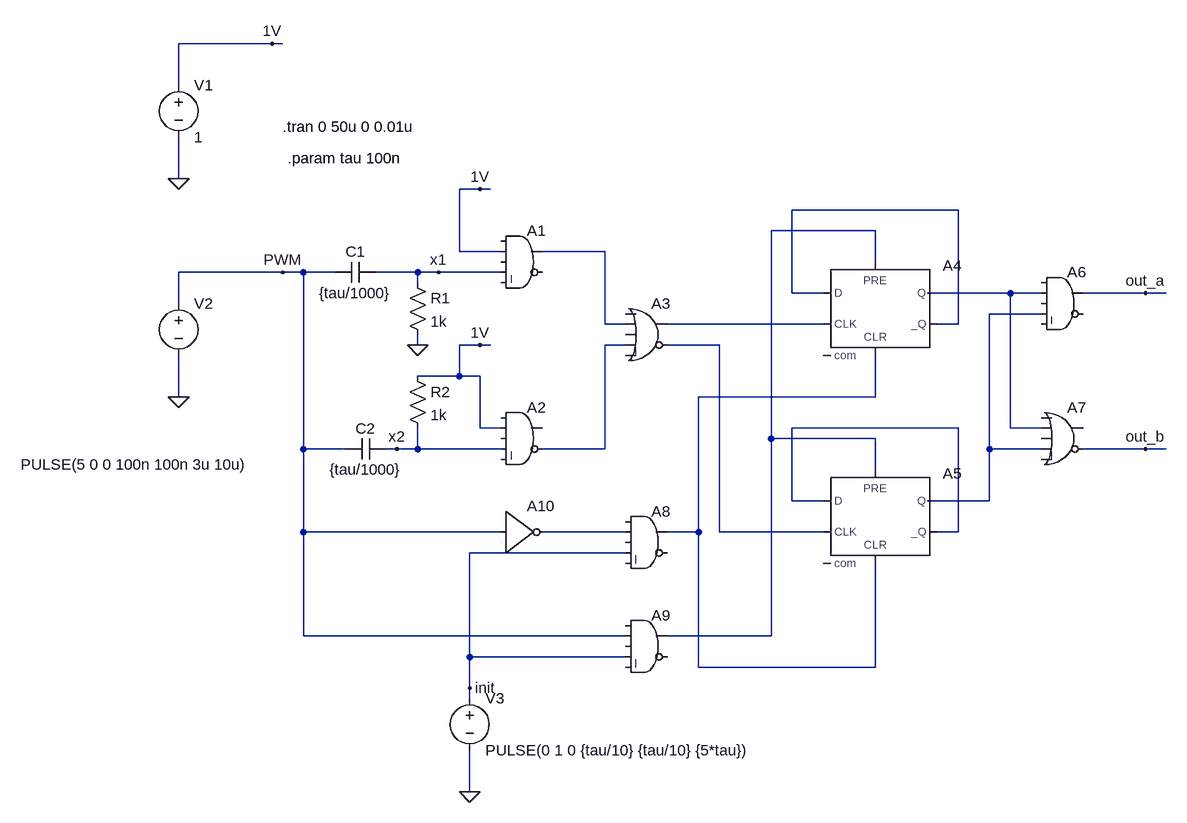
[diagram p0: schematic HB-Driver-w-programmableDT.asc]
HB-Driver-w-programmableDT.asc, the LTspice schematic file:
Version 4
SHEET 1 1492 1060
WIRE 96 -112 -48 -112
WIRE 112 -112 96 -112
WIRE -48 -48 -48 -112
WIRE -48 96 -48 32
WIRE 416 112 384 112
WIRE 432 112 416 112
WIRE 1152 144 896 144
WIRE 1024 176 864 176
WIRE 384 208 384 112
WIRE 448 208 384 208
WIRE 608 208 512 208
WIRE 1024 224 1024 176
WIRE 112 240 -48 240
WIRE 144 240 112 240
WIRE 192 240 144 240
WIRE 320 240 256 240
WIRE 352 240 320 240
WIRE 448 240 352 240
WIRE 320 256 320 240
WIRE 896 272 896 144
WIRE 944 272 896 272
WIRE 1232 272 1104 272
WIRE 1280 272 1232 272
WIRE 1440 272 1344 272
WIRE 1472 272 1440 272
WIRE -48 288 -48 240
WIRE 1280 304 1200 304
WIRE 608 320 608 208
WIRE 640 320 608 320
WIRE 944 320 704 320
WIRE 1152 320 1152 144
WIRE 1152 320 1120 320
WIRE 320 352 320 336
WIRE 416 352 384 352
WIRE 432 352 416 352
WIRE 640 352 608 352
WIRE 784 352 704 352
WIRE 384 400 384 352
WIRE 384 400 320 400
WIRE 416 400 384 400
WIRE -48 432 -48 368
WIRE 1024 432 1024 368
WIRE 1024 432 752 432
WIRE 416 480 416 400
WIRE 448 480 416 480
WIRE 1152 480 896 480
WIRE 1232 480 1232 272
WIRE 1280 480 1232 480
WIRE 864 496 864 176
WIRE 1024 496 864 496
WIRE 144 512 144 240
WIRE 208 512 144 512
WIRE 288 512 272 512
WIRE 320 512 320 480
WIRE 320 512 288 512
WIRE 448 512 320 512
WIRE 608 512 608 352
WIRE 608 512 512 512
WIRE 1200 512 1200 304
WIRE 1280 512 1200 512
WIRE 1440 512 1344 512
WIRE 1472 512 1440 512
WIRE 1024 544 1024 496
WIRE 896 592 896 480
WIRE 944 592 896 592
WIRE 1200 592 1200 512
WIRE 1200 592 1104 592
WIRE 144 640 144 512
WIRE 448 640 144 640
WIRE 640 640 512 640
WIRE 752 640 752 432
WIRE 752 640 704 640
WIRE 784 640 784 352
WIRE 944 640 784 640
WIRE 1152 640 1152 480
WIRE 1152 640 1120 640
WIRE 640 672 400 672
WIRE 144 800 144 640
WIRE 640 800 144 800
WIRE 864 800 864 496
WIRE 864 800 704 800
WIRE 400 832 400 672
WIRE 640 832 400 832
WIRE 752 848 752 640
WIRE 1024 848 1024 688
WIRE 1024 848 752 848
WIRE 400 880 400 832
WIRE 400 896 400 880
WIRE 400 1040 400 976
FLAG -48 96 0
FLAG 96 -112 1V
FLAG -48 432 0
FLAG 112 240 PWM
FLAG 320 352 0
FLAG 400 1040 0
FLAG 1440 272 out_a
FLAG 1440 512 out_b
FLAG 352 240 x1
FLAG 288 512 x2
FLAG 416 112 1V
FLAG 416 352 1V
FLAG 400 880 init
SYMBOL voltage -48 -64 R0
WINDOW 123 0 0 Left 0
WINDOW 39 0 0 Left 0
SYMATTR InstName V1
SYMATTR Value 1
SYMBOL voltage -48 272 R0
WINDOW 3 -243 264 Left 2
WINDOW 123 0 0 Left 0
WINDOW 39 0 0 Left 0
SYMATTR InstName V2
SYMATTR Value PULSE(5 0 0 100n 100n 3u 10u)
SYMBOL cap 256 224 R90
WINDOW 0 0 32 VBottom 2
WINDOW 3 32 32 VTop 2
SYMATTR InstName C1
SYMATTR Value {tau/1000}
SYMBOL cap 272 496 R90
WINDOW 0 0 32 VBottom 2
WINDOW 3 32 32 VTop 2
SYMATTR InstName C2
SYMATTR Value {tau/1000}
SYMBOL res 304 240 R0
SYMATTR InstName R1
SYMATTR Value 1k
SYMBOL res 304 384 R0
SYMATTR InstName R2
SYMATTR Value 1k
SYMBOL Digital\\and 480 160 R0
SYMATTR InstName A1
SYMBOL Digital\\and 480 432 R0
SYMATTR InstName A2
SYMBOL Digital\\or 672 272 R0
SYMATTR InstName A3
SYMBOL Digital\\dflop 1024 224 R0
SYMATTR InstName A4
SYMBOL Digital\\dflop 1024 544 R0
SYMATTR InstName A5
SYMBOL Digital\\and 1312 224 R0
SYMATTR InstName A6
SYMBOL Digital\\or 1312 432 R0
SYMATTR InstName A7
SYMBOL Digital\\and 672 592 R0
SYMATTR InstName A8
SYMBOL Digital\\and 672 752 R0
SYMATTR InstName A9
SYMBOL Digital\\inv 448 576 R0
SYMATTR InstName A10
SYMBOL voltage 400 880 R0
WINDOW 123 0 0 Left 0
WINDOW 39 0 0 Left 0
SYMATTR InstName V3
SYMATTR Value PULSE(0 1 0 {tau/10} {tau/10} {5*tau})
TEXT 112 16 Left 2 !.tran 0 50u 0 0.01u
TEXT 120 64 Left 2 !.param tau 100n

The netlist it stands for:
* HB-Driver-w-programmableDT.asc
V1 1V 0 1
V2 PWM 0 PULSE(5 0 0 100n 100n 3u 10u)
C1 x1 PWM {tau/1000}
C2 x2 PWM {tau/1000}
R1 x1 0 1k
R2 1V x2 1k
A1 0 1V 0 x1 0 0 N003 0 AND
A2 0 1V 0 x2 0 N007 0 0 AND
A3 0 N003 0 N007 0 N008 N006 0 OR
A4 N001 0 N006 N002 N009 N001 N004 0 DFLOP
A5 N010 0 N008 N002 N009 N010 N005 0 DFLOP
A6 0 N004 0 N005 0 0 out_a 0 AND
A7 0 N004 0 N005 0 out_b 0 0 OR
A8 0 N011 0 init 0 0 N009 0 AND
A9 0 PWM 0 init 0 0 N002 0 AND
A10 PWM 0 0 0 0 N011 0 0 BUF
V3 init 0 PULSE(0 1 0 {tau/10} {tau/10} {5*tau})
.tran 0 50u 0 0.01u
.param tau 100n
.backanno
.end

* Results of the author's LTspice run, read from the files saved beside the schematic
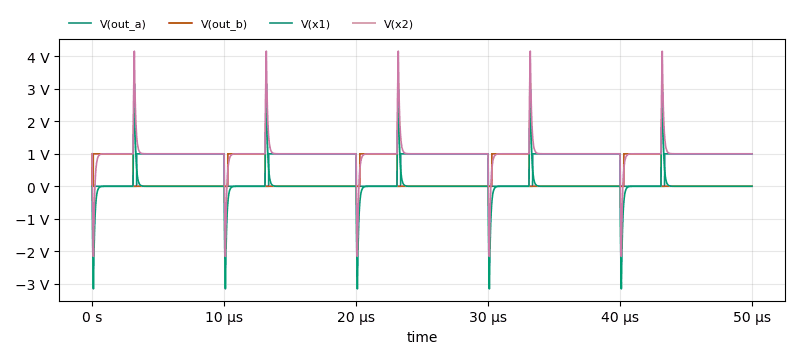
[diagram p1: Transient Analysis of HB-Driver-w-programmableDT.asc, plotted from the saved traces]
* Transient Analysis, 1 run:
*   V(out_a): min 0 V, max 1 V, average 664.7 mV, rms 815.3 mV, last 1 V
*   V(out_b): min 0 V, max 1 V, average 286.7 mV, rms 535.5 mV, last 0 V
*   V(x1): min -3.162 V, max 3.162 V, average -30.85 µV, rms 429.8 mV, last 0 V
*   V(x2): min -2.162 V, max 4.162 V, average 1 V, rms 1.088 V, last 1 V